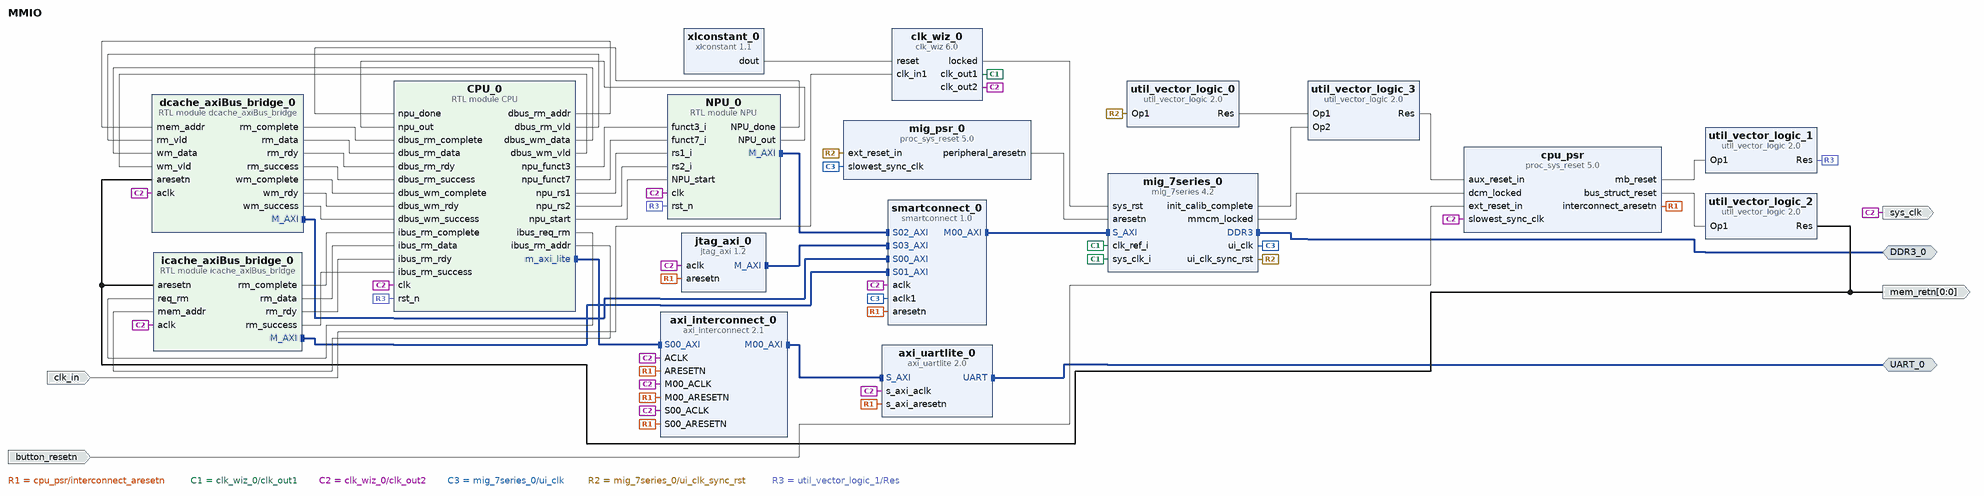
[diagram p0: block diagram of the top level]
# Vivado block design MMIO, xc7a100tcsg324-1, Vivado 2023.2
create_bd_design MMIO

create_bd_intf_port -mode Master -vlnv xilinx.com:interface:uart_rtl:1.0 UART_0
create_bd_intf_port -mode Master -vlnv xilinx.com:interface:ddrx_rtl:1.0 DDR3_0
create_bd_port -dir I -type clk clk_in
create_bd_port -dir I -type rst button_resetn
create_bd_port -dir O -from 0 -to 0 -type rst mem_retn
create_bd_port -dir O sys_clk

create_bd_cell -type ip -vlnv xilinx.com:ip:axi_interconnect:2.1 axi_interconnect_0
set_property -dict {CONFIG.NUM_MI 1} [get_bd_cells axi_interconnect_0]
create_bd_cell -type ip -vlnv xilinx.com:ip:mig_7series:4.2 mig_7series_0
set_property -dict [list \
  CONFIG.BOARD_MIG_PARAM Custom \
  CONFIG.MIG_DONT_TOUCH_PARAM Custom \
  CONFIG.RESET_BOARD_INTERFACE Custom \
  CONFIG.XML_INPUT_FILE mig_b.prj \
] [get_bd_cells mig_7series_0]
create_bd_cell -type module -reference icache_axiBus_bridge icache_axiBus_bridge_0
create_bd_cell -type module -reference dcache_axiBus_bridge dcache_axiBus_bridge_0
create_bd_cell -type ip -vlnv xilinx.com:ip:xlconstant:1.1 xlconstant_0
set_property -dict {CONFIG.CONST_VAL 0} [get_bd_cells xlconstant_0]
create_bd_cell -type ip -vlnv xilinx.com:ip:util_vector_logic:2.0 util_vector_logic_0
set_property -dict {CONFIG.C_OPERATION not CONFIG.C_SIZE 1} [get_bd_cells util_vector_logic_0]
create_bd_cell -type ip -vlnv xilinx.com:ip:proc_sys_reset:5.0 cpu_psr
create_bd_cell -type ip -vlnv xilinx.com:ip:util_vector_logic:2.0 util_vector_logic_1
set_property -dict {CONFIG.C_OPERATION not CONFIG.C_SIZE 1} [get_bd_cells util_vector_logic_1]
create_bd_cell -type ip -vlnv xilinx.com:ip:util_vector_logic:2.0 util_vector_logic_2
set_property -dict {CONFIG.C_OPERATION not CONFIG.C_SIZE 1} [get_bd_cells util_vector_logic_2]
create_bd_cell -type ip -vlnv xilinx.com:ip:axi_uartlite:2.0 axi_uartlite_0
set_property -dict {CONFIG.C_BAUDRATE 115200 CONFIG.C_S_AXI_ACLK_FREQ_HZ 50000000} [get_bd_cells axi_uartlite_0]
create_bd_cell -type ip -vlnv xilinx.com:ip:smartconnect:1.0 smartconnect_0
set_property -dict {CONFIG.NUM_CLKS 2 CONFIG.NUM_SI 4} [get_bd_cells smartconnect_0]
create_bd_cell -type ip -vlnv xilinx.com:ip:util_vector_logic:2.0 util_vector_logic_3
set_property -dict {CONFIG.C_OPERATION or CONFIG.C_SIZE 2} [get_bd_cells util_vector_logic_3]
create_bd_cell -type module -reference NPU NPU_0
create_bd_cell -type module -reference CPU CPU_0
create_bd_cell -type ip -vlnv xilinx.com:ip:clk_wiz:6.0 clk_wiz_0
set_property -dict [list \
  CONFIG.CLKOUT1_JITTER 114.829 \
  CONFIG.CLKOUT1_PHASE_ERROR 98.575 \
  CONFIG.CLKOUT1_REQUESTED_OUT_FREQ 200.000 \
  CONFIG.CLKOUT2_JITTER 151.636 \
  CONFIG.CLKOUT2_PHASE_ERROR 98.575 \
  CONFIG.CLKOUT2_REQUESTED_OUT_FREQ 50.0 \
  CONFIG.CLKOUT2_USED true \
  CONFIG.MMCM_CLKFBOUT_MULT_F 10.000 \
  CONFIG.MMCM_CLKOUT0_DIVIDE_F 5.000 \
  CONFIG.MMCM_CLKOUT1_DIVIDE 20 \
  CONFIG.NUM_OUT_CLKS 2 \
] [get_bd_cells clk_wiz_0]
create_bd_cell -type ip -vlnv xilinx.com:ip:jtag_axi:1.2 jtag_axi_0
set_property -dict {CONFIG.WR_TXN_QUEUE_LENGTH 8} [get_bd_cells jtag_axi_0]
create_bd_cell -type ip -vlnv xilinx.com:ip:proc_sys_reset:5.0 mig_psr_0

# ---- connections ----

connect_bd_intf_net [get_bd_intf_pins CPU_0/m_axi_lite] [get_bd_intf_pins axi_interconnect_0/S00_AXI]
connect_bd_intf_net [get_bd_intf_pins NPU_0/M_AXI] [get_bd_intf_pins smartconnect_0/S02_AXI]
connect_bd_intf_net [get_bd_intf_pins axi_interconnect_0/M00_AXI] [get_bd_intf_pins axi_uartlite_0/S_AXI]
connect_bd_intf_net [get_bd_intf_ports UART_0] [get_bd_intf_pins axi_uartlite_0/UART]
connect_bd_intf_net [get_bd_intf_pins dcache_axiBus_bridge_0/M_AXI] [get_bd_intf_pins smartconnect_0/S00_AXI]
connect_bd_intf_net [get_bd_intf_pins icache_axiBus_bridge_0/M_AXI] [get_bd_intf_pins smartconnect_0/S01_AXI]
connect_bd_intf_net [get_bd_intf_pins jtag_axi_0/M_AXI] [get_bd_intf_pins smartconnect_0/S03_AXI]
connect_bd_intf_net [get_bd_intf_ports DDR3_0] [get_bd_intf_pins mig_7series_0/DDR3]
connect_bd_intf_net [get_bd_intf_pins smartconnect_0/M00_AXI] [get_bd_intf_pins mig_7series_0/S_AXI]
connect_bd_net [get_bd_pins CPU_0/dbus_rm_addr] [get_bd_pins dcache_axiBus_bridge_0/mem_addr]
connect_bd_net [get_bd_pins CPU_0/dbus_rm_vld] [get_bd_pins dcache_axiBus_bridge_0/rm_vld]
connect_bd_net [get_bd_pins CPU_0/dbus_wm_data] [get_bd_pins dcache_axiBus_bridge_0/wm_data]
connect_bd_net [get_bd_pins CPU_0/dbus_wm_vld] [get_bd_pins dcache_axiBus_bridge_0/wm_vld]
connect_bd_net [get_bd_pins CPU_0/ibus_req_rm] [get_bd_pins icache_axiBus_bridge_0/req_rm]
connect_bd_net [get_bd_pins CPU_0/ibus_rm_addr] [get_bd_pins icache_axiBus_bridge_0/mem_addr]
connect_bd_net [get_bd_pins CPU_0/npu_funct3] [get_bd_pins NPU_0/funct3_i]
connect_bd_net [get_bd_pins CPU_0/npu_funct7] [get_bd_pins NPU_0/funct7_i]
connect_bd_net [get_bd_pins CPU_0/npu_rs1] [get_bd_pins NPU_0/rs1_i]
connect_bd_net [get_bd_pins CPU_0/npu_rs2] [get_bd_pins NPU_0/rs2_i]
connect_bd_net [get_bd_pins CPU_0/npu_start] [get_bd_pins NPU_0/NPU_start]
connect_bd_net -net M01_ARESETN_1 [get_bd_pins cpu_psr/interconnect_aresetn] \
  [get_bd_pins axi_interconnect_0/ARESETN] [get_bd_pins axi_interconnect_0/S00_ARESETN] \
  [get_bd_pins axi_interconnect_0/M00_ARESETN] [get_bd_pins axi_uartlite_0/s_axi_aresetn] [get_bd_pins jtag_axi_0/aresetn] \
  [get_bd_pins smartconnect_0/aresetn]
connect_bd_net [get_bd_pins NPU_0/NPU_done] [get_bd_pins CPU_0/npu_done]
connect_bd_net [get_bd_pins NPU_0/NPU_out] [get_bd_pins CPU_0/npu_out]
connect_bd_net [get_bd_ports clk_in] [get_bd_pins clk_wiz_0/clk_in1]
connect_bd_net [get_bd_pins clk_wiz_0/clk_out1] [get_bd_pins mig_7series_0/clk_ref_i] [get_bd_pins mig_7series_0/sys_clk_i]
connect_bd_net [get_bd_pins clk_wiz_0/locked] [get_bd_pins mig_7series_0/sys_rst]
connect_bd_net [get_bd_pins cpu_psr/bus_struct_reset] [get_bd_pins util_vector_logic_2/Op1]
connect_bd_net [get_bd_pins cpu_psr/mb_reset] [get_bd_pins util_vector_logic_1/Op1]
connect_bd_net [get_bd_pins dcache_axiBus_bridge_0/rm_complete] [get_bd_pins CPU_0/dbus_rm_complete]
connect_bd_net [get_bd_pins dcache_axiBus_bridge_0/rm_data] [get_bd_pins CPU_0/dbus_rm_data]
connect_bd_net [get_bd_pins dcache_axiBus_bridge_0/rm_rdy] [get_bd_pins CPU_0/dbus_rm_rdy]
connect_bd_net [get_bd_pins dcache_axiBus_bridge_0/rm_success] [get_bd_pins CPU_0/dbus_rm_success]
connect_bd_net [get_bd_pins dcache_axiBus_bridge_0/wm_complete] [get_bd_pins CPU_0/dbus_wm_complete]
connect_bd_net [get_bd_pins dcache_axiBus_bridge_0/wm_rdy] [get_bd_pins CPU_0/dbus_wm_rdy]
connect_bd_net [get_bd_pins dcache_axiBus_bridge_0/wm_success] [get_bd_pins CPU_0/dbus_wm_success]
connect_bd_net -net ext_reset_in_0_1 [get_bd_ports button_resetn] [get_bd_pins cpu_psr/ext_reset_in]
connect_bd_net [get_bd_pins icache_axiBus_bridge_0/rm_complete] [get_bd_pins CPU_0/ibus_rm_complete]
connect_bd_net [get_bd_pins icache_axiBus_bridge_0/rm_data] [get_bd_pins CPU_0/ibus_rm_data]
connect_bd_net [get_bd_pins icache_axiBus_bridge_0/rm_rdy] [get_bd_pins CPU_0/ibus_rm_rdy]
connect_bd_net [get_bd_pins icache_axiBus_bridge_0/rm_success] [get_bd_pins CPU_0/ibus_rm_success]
connect_bd_net [get_bd_pins mig_7series_0/init_calib_complete] [get_bd_pins util_vector_logic_3/Op2]
connect_bd_net [get_bd_pins mig_7series_0/mmcm_locked] [get_bd_pins cpu_psr/dcm_locked]
connect_bd_net -net mig_7series_0_ui_clk [get_bd_pins clk_wiz_0/clk_out2] \
  [get_bd_ports sys_clk] [get_bd_pins dcache_axiBus_bridge_0/aclk] [get_bd_pins icache_axiBus_bridge_0/aclk] \
  [get_bd_pins CPU_0/clk] [get_bd_pins NPU_0/clk] [get_bd_pins axi_interconnect_0/ACLK] \
  [get_bd_pins axi_interconnect_0/S00_ACLK] [get_bd_pins axi_interconnect_0/M00_ACLK] [get_bd_pins axi_uartlite_0/s_axi_aclk] \
  [get_bd_pins jtag_axi_0/aclk] [get_bd_pins cpu_psr/slowest_sync_clk] [get_bd_pins smartconnect_0/aclk]
connect_bd_net [get_bd_pins mig_7series_0/ui_clk] [get_bd_pins mig_psr_0/slowest_sync_clk] [get_bd_pins smartconnect_0/aclk1]
connect_bd_net [get_bd_pins mig_7series_0/ui_clk_sync_rst] [get_bd_pins mig_psr_0/ext_reset_in] [get_bd_pins util_vector_logic_0/Op1]
connect_bd_net [get_bd_pins mig_psr_0/peripheral_aresetn] [get_bd_pins mig_7series_0/aresetn]
connect_bd_net [get_bd_pins util_vector_logic_0/Res] [get_bd_pins util_vector_logic_3/Op1]
connect_bd_net [get_bd_pins util_vector_logic_1/Res] [get_bd_pins CPU_0/rst_n] [get_bd_pins NPU_0/rst_n]
connect_bd_net [get_bd_pins util_vector_logic_2/Res] \
  [get_bd_ports mem_retn] [get_bd_pins dcache_axiBus_bridge_0/aresetn] [get_bd_pins icache_axiBus_bridge_0/aresetn]
connect_bd_net [get_bd_pins util_vector_logic_3/Res] [get_bd_pins cpu_psr/aux_reset_in]
connect_bd_net [get_bd_pins xlconstant_0/dout] [get_bd_pins clk_wiz_0/reset]

# ---- address map ----
assign_bd_address -offset 0x40005000 -range 4K -target_address_space [get_bd_addr_spaces CPU_0/m_axi_lite] [get_bd_addr_segs axi_uartlite_0/S_AXI/Reg]
assign_bd_address -offset 0x60000000 -range 256M -target_address_space [get_bd_addr_spaces dcache_axiBus_bridge_0/M_AXI] [get_bd_addr_segs mig_7series_0/memmap/memaddr]
assign_bd_address -offset 0x60000000 -range 256M -target_address_space [get_bd_addr_spaces icache_axiBus_bridge_0/M_AXI] [get_bd_addr_segs mig_7series_0/memmap/memaddr]
assign_bd_address -offset 0x60000000 -range 256M -target_address_space [get_bd_addr_spaces jtag_axi_0/Data] [get_bd_addr_segs mig_7series_0/memmap/memaddr]
assign_bd_address -offset 0x60000000 -range 256M -target_address_space [get_bd_addr_spaces NPU_0/M_AXI] [get_bd_addr_segs mig_7series_0/memmap/memaddr]

validate_bd_design
save_bd_design
